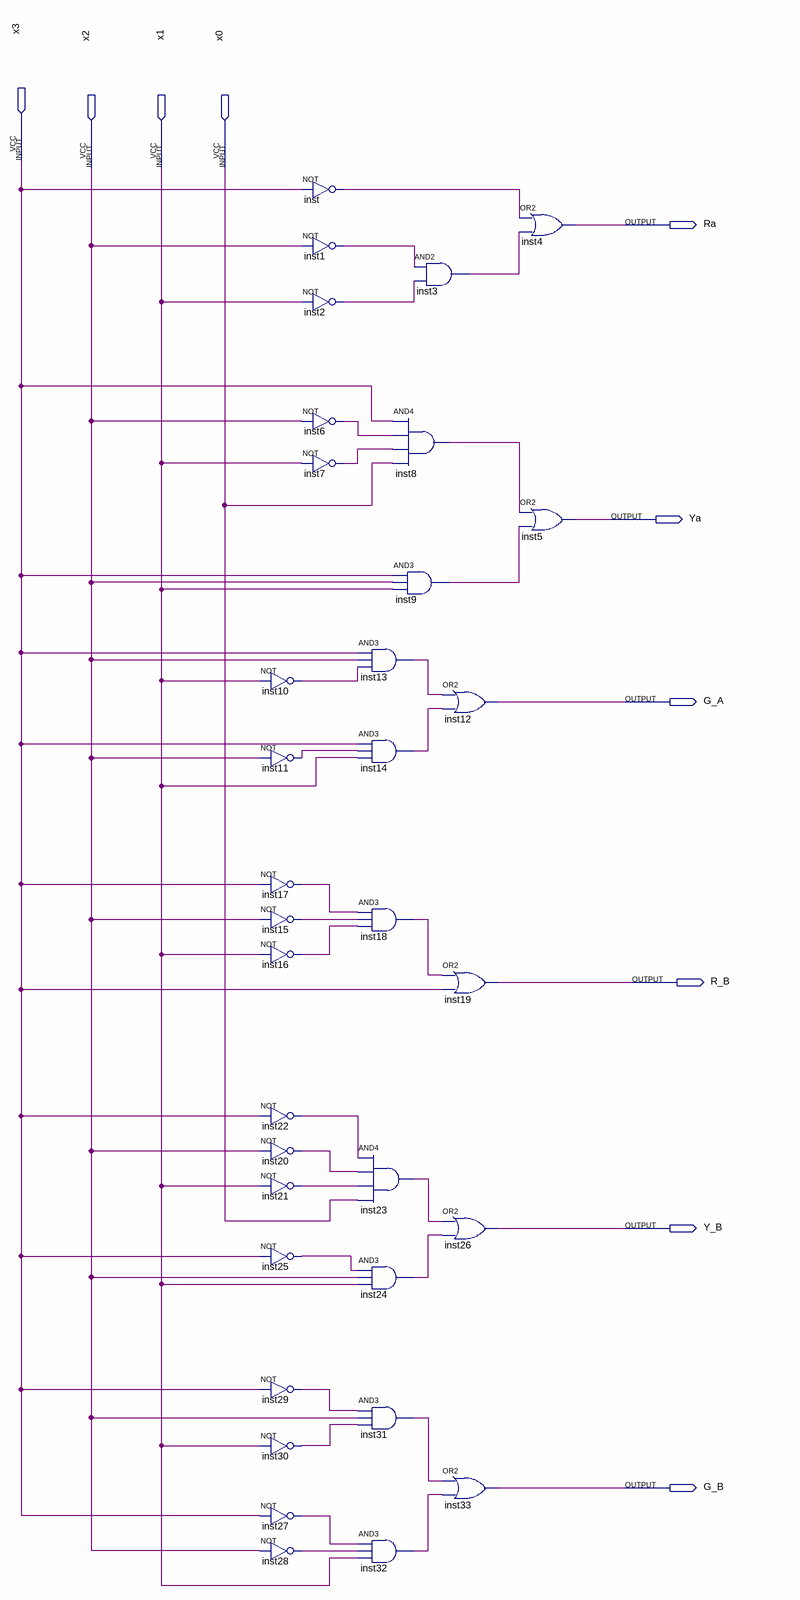
[diagram p0: schematic sheet]
// Quartus schematic TrafficLight.bdf as structural Verilog: 34 symbols, 10 pins
module TrafficLight (
  input  x3,
  input  x2,
  input  x1,
  input  x0,
  output Ra,
  output Ya,
  output G_A,
  output R_B,
  output Y_B,
  output G_B
);

  wire inst1_out, inst2_out, inst3_out, inst6_out, inst7_out, inst8_out, inst9_out, inst10_out, inst11_out,
       inst13_out, inst14_out, inst15_out, inst16_out, inst17_out, inst18_out, inst20_out, inst21_out,
       inst22_out, inst23_out, inst24_out, inst25_out, inst27_out, inst28_out, inst29_out, inst30_out,
       inst31_out, inst32_out, inst_out;

  not inst (inst_out, x3);
  not inst1 (inst1_out, x2);
  not inst2 (inst2_out, x1);
  not inst6 (inst6_out, x2);
  not inst7 (inst7_out, x1);
  not inst10 (inst10_out, x1);
  not inst11 (inst11_out, x2);
  not inst17 (inst17_out, x3);
  not inst15 (inst15_out, x2);
  not inst16 (inst16_out, x1);
  not inst22 (inst22_out, x3);
  not inst20 (inst20_out, x2);
  not inst21 (inst21_out, x1);
  not inst25 (inst25_out, x3);
  not inst29 (inst29_out, x3);
  not inst30 (inst30_out, x1);
  not inst27 (inst27_out, x3);
  not inst28 (inst28_out, x2);
  and inst13 (inst13_out, x3, x2, inst10_out);
  and inst14 (inst14_out, x3, inst11_out, x1);
  and inst18 (inst18_out, inst17_out, inst15_out, inst16_out);
  and inst23 (inst23_out, inst22_out, inst20_out, inst21_out, x0);
  and inst24 (inst24_out, inst25_out, x2, x1);
  and inst31 (inst31_out, inst29_out, x2, inst30_out);
  and inst32 (inst32_out, inst27_out, inst28_out, x1);
  and inst3 (inst3_out, inst1_out, inst2_out);
  and inst8 (inst8_out, x3, inst6_out, inst7_out, x0);
  and inst9 (inst9_out, x3, x2, x1);
  or inst12 (G_A, inst13_out, inst14_out);
  or inst19 (R_B, inst18_out, x3);
  or inst26 (Y_B, inst23_out, inst24_out);
  or inst33 (G_B, inst31_out, inst32_out);
  or inst4 (Ra, inst_out, inst3_out);
  or inst5 (Ya, inst8_out, inst9_out);
endmodule
